# Altium schematic sheet alim_portes_logic.SchDoc
size A4; SheetNumber: 2; SheetTotal: 6
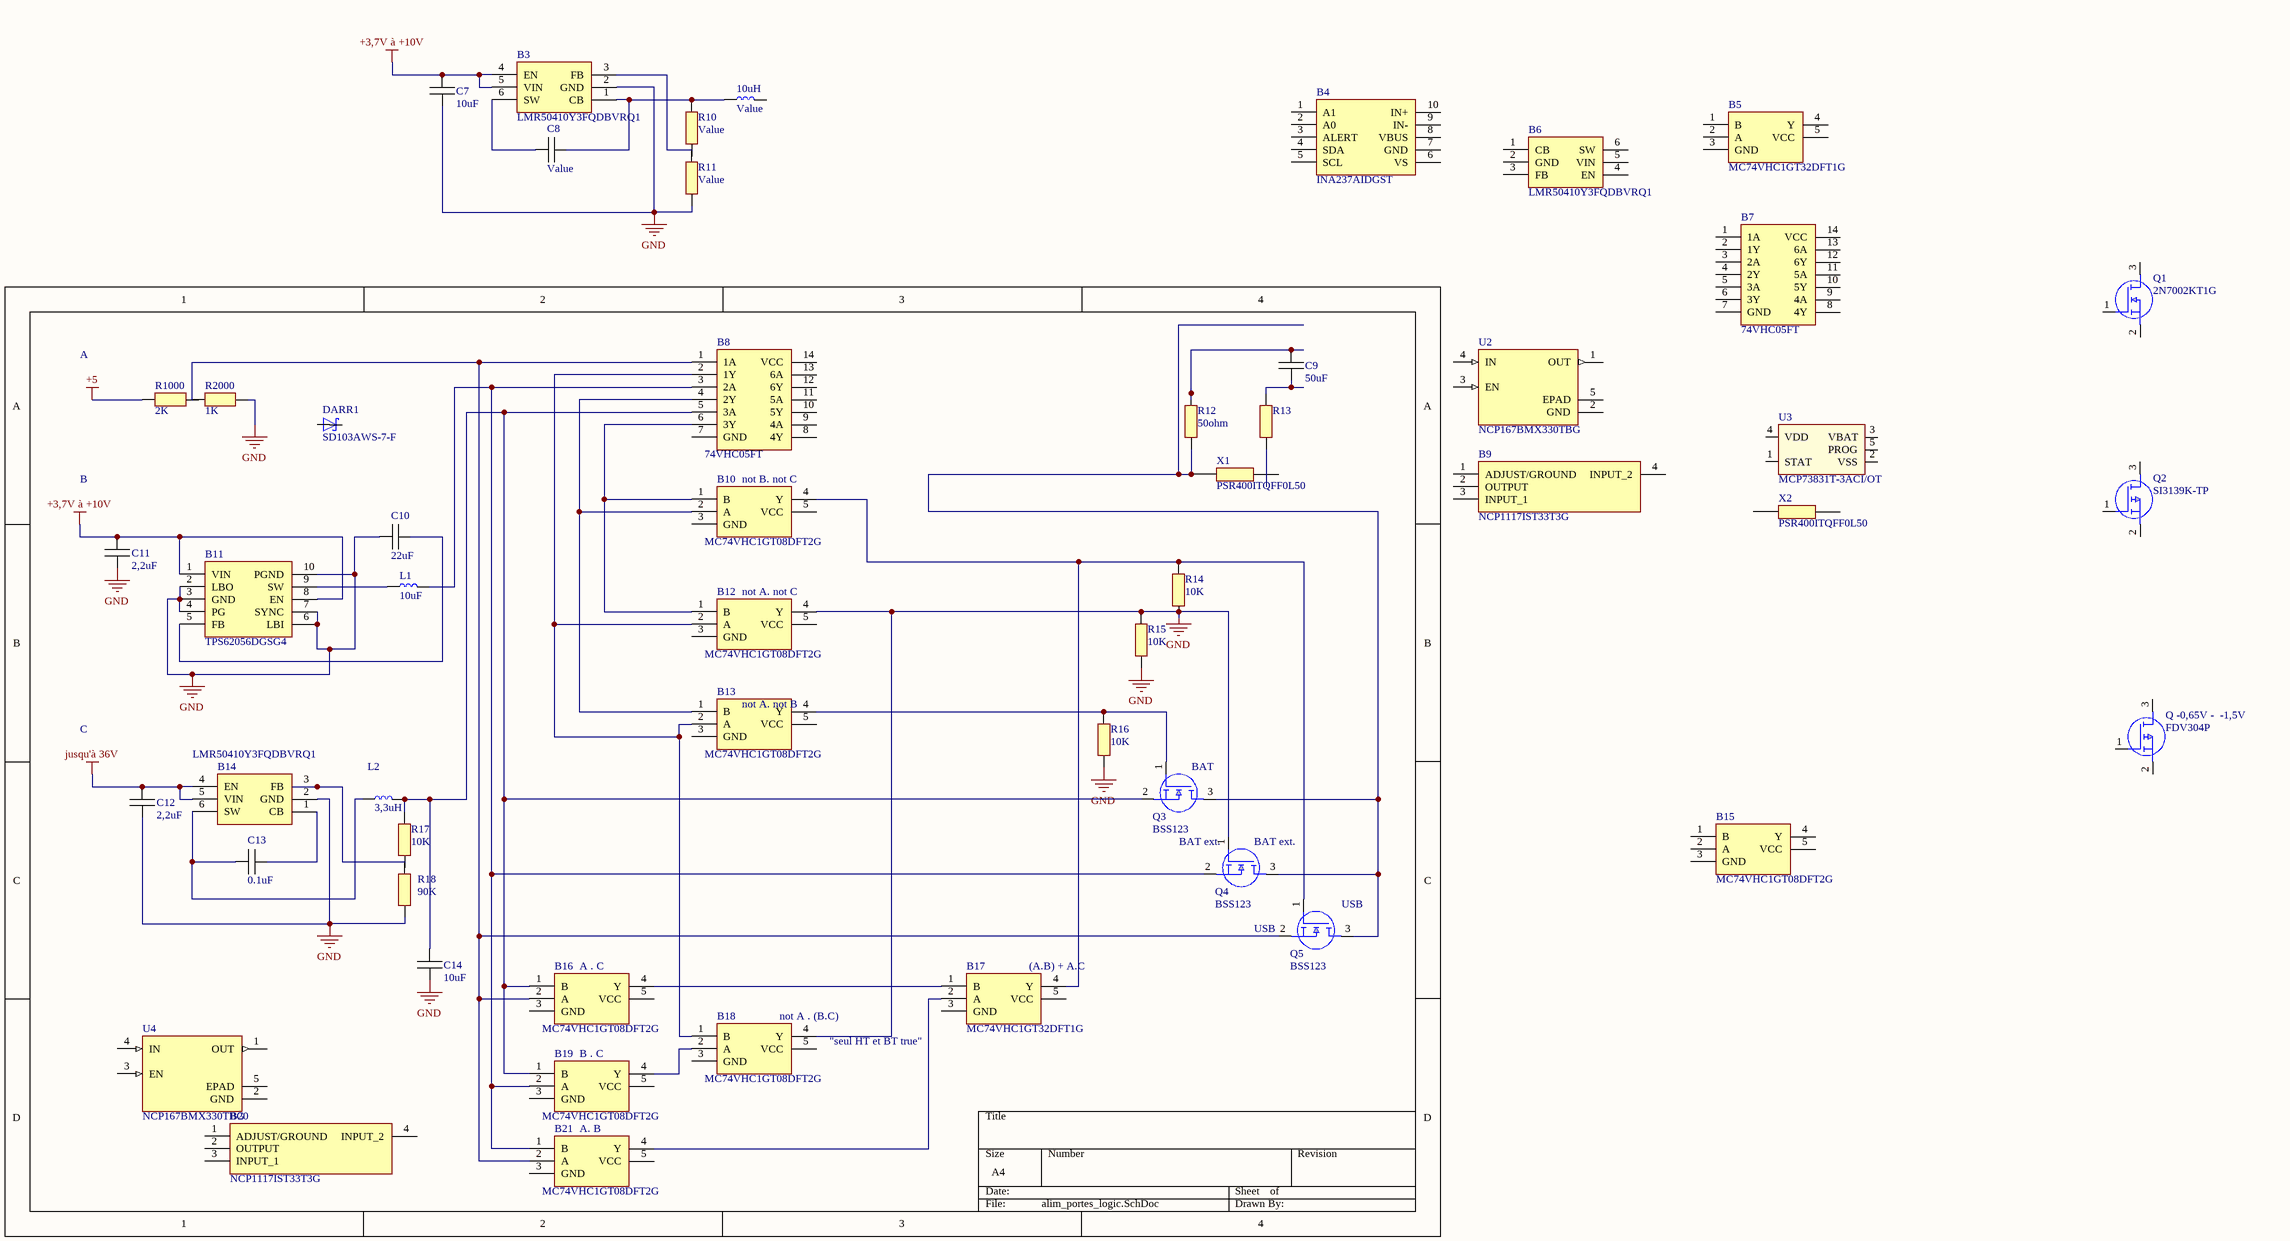
[diagram p0: alim_portes_logic.SchDoc]

## Parts
10uH  Value  [LQPC1005X06N]
B3  LMR50410Y3FQDBVRQ1  [SOT95P280X145-6N]
B4  INA237AIDGST  [SOP50P490X110-10N]
B5  MC74VHC1GT32DFT1G  [SOT65P210X110-5N]
B6  LMR50410Y3FQDBVRQ1  [SOT95P280X145-6N]
B7  74VHC05FT  [SOP65P640X120-14N]
B8  74VHC05FT  [SOP65P640X120-14N]
B9  NCP1117IST33T3G  [SOT230P700X180-4N]
B10  MC74VHC1GT08DFT2G  [SOT65P210X110-5N]
B11  TPS62056DGSG4  [SOP50P490X110-10N]
B12  MC74VHC1GT08DFT2G  [SOT65P210X110-5N]
B13  MC74VHC1GT08DFT2G  [SOT65P210X110-5N]
B14  LMR50410Y3FQDBVRQ1  [SOT95P280X145-6N]
B15  MC74VHC1GT08DFT2G  [SOT65P210X110-5N]
B16  MC74VHC1GT08DFT2G  [SOT65P210X110-5N]
B17  MC74VHC1GT32DFT1G  [SOT65P210X110-5N]
B18  MC74VHC1GT08DFT2G  [SOT65P210X110-5N]
B19  MC74VHC1GT08DFT2G  [SOT65P210X110-5N]
B20  NCP1117IST33T3G  [SOT230P700X180-4N]
B21  MC74VHC1GT08DFT2G  [SOT65P210X110-5N]
C7  10uF  [CAPC1005X06N]
C8  Value  [CAPC1005X06N]
C9  50uF  [CAPC1005X06N]
C10  22uF  [CAPC1005X06N]
C11  2,2uF  [CAPC1005X06N]
C12  2,2uF  [CAPC1005X06N]
C13  0.1uF  [CAPC1005X06N]
C14  10uF  [CAPC1005X06N]
DARR1  SD103AWS-7-F  [SD103AWS-7-F]
L1  10uF  [LQPC1005X06N]
L2  3,3uH  [LQPC1005X06N]
Q1  2N7002KT1G  [SOT96P237X111-3N]
Q2  SI3139K-TP  [SI3139K-TP]
Q3  BSS123  [BSS123]
Q4  BSS123  [BSS123]
Q5  BSS123  [BSS123]
Q_-0,65V_-_-1,5V  FDV304P  [SOT95P251X112-3N]
R10  Value  [RESC1005X06N]
R11  Value  [RESC1005X06N]
R12  50ohm  [RESC1005X06N]
R13  (no value)  [RESC1005X06N]
R14  10K  [RESC1005X06N]
R15  10K  [RESC1005X06N]
R16  10K  [RESC1005X06N]
R17  10K  [RESC1005X06N]
R18  90K  [RESC1005X06N]
R1000  2K  [RESC1005X06N]
R2000  1K  [RESC1005X06N]
U2  NCP167BMX330TBG  [NCP167BMX330TBG]
U3  MCP73831T-3ACI/OT  [SOT95P280X145-5N]
U4  NCP167BMX330TBG  [NCP167BMX330TBG]
X1  PSR400ITQFF0L50  [RESC10052X200N]
X2  PSR400ITQFF0L50  [RESC10052X200N]

## Nets
+3,7V à +10V: B3.4(EN) B3.5(VIN) B11.1(VIN) B11.8(EN) C7.1 C11.1
+5: R1000.1
GND: B3.2(GND) B11.2(LBO) B11.3(GND) B11.4(PG) B11.6(LBI) B11.7(SYNC) B11.10(PGND) B12.4(Y) B14.2(GND) B18.4(Y) C7.2 C10.2 C11.2 C12.2 C14.2 Q4.1(G) R11.2 R14.2 R15.1 R15.2 R16.2 R18.2 R2000.2
jusqu'à 36V: B14.4(EN) B14.5(VIN) C12.1
Net10uH_1: 10uH.1 B3.1(CB) C8.1 R10.1
NetB3_3: B3.3(FB) R11.1
NetB3_6: B3.6(SW) C8.2
NetB8_1: B8.1(1A) B16.2(A) B21.2(A) Q5.2(S) R2000.1
NetB8_2: B8.2(1Y) B12.2(A) B13.2(A) B18.1(B)
NetB8_3: B8.3(2A) B19.2(A) B21.1(B) L1.2 Q4.2(S)
NetB8_4: B8.4(2Y) B10.2(A) B13.1(B)
NetB8_5: B8.5(3A) B16.1(B) B19.1(B) C14.1 L2.2 Q3.2(S) R17.1
NetB8_6: B8.6(3Y) B10.1(B) B12.1(B)
NetB10_4: B10.4(Y) B17.4(Y) Q5.1(G) R14.1
NetB11_5: B11.5(FB) C10.1
NetB11_9: B11.9(SW) L1.1
NetB13_4: B13.4(Y) Q3.1(G) R16.1
NetB14_1: B14.1(CB) C13.1
NetB14_3: B14.3(FB) R18.1
NetB14_6: B14.6(SW) C13.2 L2.1
NetB16_4: B16.4(Y) B17.1(B)
NetB17_2: B17.2(A) B21.4(Y)
NetB18_2: B18.2(A) B19.4(Y)
NetC9_1: C9.1 R12.2
NetC9_2: C9.2 R13.2
NetQ3_3: Q3.3(D) Q4.3(D) Q5.3(D) R12.1 X1.1

Not connected (* = marked no-connect by the designer): 10uH 2; B4 1(A1) 2(A0) 3(ALERT) 4(SDA) 5(SCL) 6(VS) 7(GND) 8(VBUS) 9(IN-) 10(IN+); B5 1(B) 2(A) 3(GND) 4(Y) 5(VCC); B6 1(CB) 2(GND) 3(FB) 4(EN) 5(VIN) 6(SW); B7 1(1A) 2(1Y) 3(2A) 4(2Y) 5(3A) 6(3Y) 7(GND) 8(4Y) 9(4A) 10(5Y) 11(5A) 12(6Y) 13(6A) 14(VCC); B8 7(GND) 8(4Y) 9(4A) 10(5Y) 11(5A) 12(6Y) 13(6A) 14(VCC); B9 1(ADJUST/GROUND) 2(OUTPUT) 3(INPUT_1) 4(INPUT_2); B10 3(GND) 5(VCC); B12 3(GND) 5(VCC); B13 3(GND) 5(VCC); B15 1(B) 2(A) 3(GND) 4(Y) 5(VCC); B16 3(GND) 5(VCC); B17 3(GND) 5(VCC); B18 3(GND) 5(VCC); B19 3(GND) 5(VCC); B20 1(ADJUST/GROUND) 2(OUTPUT) 3(INPUT_1) 4(INPUT_2); B21 3(GND) 5(VCC); DARR1 1(C) 2(A); Q1 1(G) 2(S) 3(D); Q2 1(G) 2(S) 3(D); Q_-0,65V_-_-1,5V 1(G) 2(S) 3(D); R10 2; R13 1; R17 2; R1000 2; U2 1(OUT) 2(GND) 3(EN) 4(IN) 5(EPAD); U3 1(STAT) 2(VSS) 3(VBAT) 4(VDD) 5(PROG); U4 1(OUT) 2(GND) 3(EN) 4(IN) 5(EPAD); X1 2; X2 1 2

## Notes on the sheet
- A
- B
- (near B10) not B. not C
- (near B12) not A. not C
- C
- (near B13) not A. not B
- (near Q3) BAT
- (near Q4) BAT ext.
- (near Q5) USB
- (near B16) A . C
- (near B17) (A.B) + A.C
- (near B19) B . C
- (near B18) not A . (B.C)
- "seul HT et BT true"
- (near B21) A. B

## Library data of the parts
10uH L1 L2 = Bobine
B3 B6 B14 = LMR50410Y3FQDBVRQ1: Régulateurs de tension de commutation Automotive qualified SIMPLE SWITCHER 4-V to 36-V, 1-A synchronous step-down converter 6-SOT-23 -40 to 150; Manufacturer_Name: Texas Instruments; Manufacturer_Part_Number: LMR50410Y3FQDBVRQ1; Mouser Part Number: 595-R50410Y3FQDBVRQ1
B4 = INA237AIDGST: Current Sense Amplifiers 85-V, 16-bit, I2C output current/voltage/power monitor with alert 10-VSSOP -40 to 125; Manufacturer_Name: Texas Instruments; Manufacturer_Part_Number: INA237AIDGST; Mouser Part Number: 595-INA237AIDGST
B5 B17 = MC74VHC1GT32DFT1G: Single 2-Input OR Gate, TTL Level; Manufacturer_Name: onsemi; Manufacturer_Part_Number: MC74VHC1GT32DFT1G; Mouser Part Number: 863-C74VHC1GT32DFT1G
B7 B8 = 74VHC05FT: Logic Gates CMOS LOGIC IC INVERTER; Manufacturer_Name: Toshiba; Manufacturer_Part_Number: 74VHC05FT; Mouser Part Number: 757-74VHC05FT
B9 B20 = NCP1117IST33T3G: Linear Voltage Regulator IC Positive Fixed 1 Output 1A SOT-223; Parameter 1: onsemi; Parameter 3: 863-NCP1117IST33T3G; Parameter 2: NCP1117IST33T3G
B10 B12 B13 B15 B16 B18 B19 B21 = MC74VHC1GT08DFT2G: Single 2-Input AND Gate, TTL Level; Manufacturer_Name: onsemi; Manufacturer_Part_Number: MC74VHC1GT08DFT2G; Parameter 3: *
B11 = TPS62056DGSG4: TEXAS INSTRUMENTS - TPS62056DGSG4 - Synchronous Buck (Step Down) Switching Regulator, Fixed, 2.7V-10Vin, 3.3V/0.8A out, 850kHz, VSSOP-10; Manufacturer_Name: Texas Instruments; Manufacturer_Part_Number: TPS62056DGSG4; Mouser Part Number: 595-TPS62056DGSG4
C7-C14 = Capacitor
DARR1 = SD103AWS-7-F: Diode Array 3 Independent Schottky 40V 175mA Surface Mount 6-TSSOP, SC-88, SOT-363
Q1 = 2N7002KT1G: MOSFET N-Ch 60V 380mA Small Signal SOT23 ON Semiconductor 2N7002KT1G N-channel MOSFET Transistor, 380 mA, 60 V, 3-Pin SOT-23; Manufacturer_Name: onsemi; Geometry.Height: 1.11mm; Manufacturer_Part_Number: 2N7002KT1G; Mouser Part Number: 863-2N7002KT1G; Mouser Price/Stock: https://www.mouser.co.uk/ProductDetail/onsemi/2N7002KT1G?qs=Jh7l0IbPjifUiTytu%252BGGDQ%3D%3D; Arrow Part Number: 2N7002KT1G; Arrow Price/Stock: https://www.arrow.com/en/products/2n7002kt1g/on-semiconductor?utm_currency=USD&region=nac; Datasheet Link: http://www.onsemi.com/pub/Collateral/2N7002K-D.PDF
Q2 = SI3139K-TP: MOSFET P-Channel MOSFET
Q3-Q5 = BSS123: BSS123 N-Channel MOSFET, 170 mA, 100 V PowerTrench, 3-Pin SOT-23 ON Semiconductor
Q_-0,65V_-_-1,5V = FDV304P: ON SEMICONDUCTOR - FDV304P - Power MOSFET, P Channel, 25 V, 460 mA, 1.22 ohm, SOT-23, Surface Mount; Manufacturer_Name: onsemi; Geometry.Height: 1.12mm; Manufacturer_Part_Number: FDV304P; Mouser Part Number: 512-FDV304P; Mouser Price/Stock: https://www.mouser.co.uk/ProductDetail/onsemi-Fairchild/FDV304P?qs=FOlmdCx%252BAA1BAlCQZu888w%3D%3D; Arrow Part Number: FDV304P; Arrow Price/Stock: https://www.arrow.com/en/products/fdv304p/on-semiconductor?utm_currency=USD&region=europe; Datasheet Link: https://componentsearchengine.com/Datasheets/2/FDV304P.pdf
R10-R18 R1000 R2000 = Resistor
U2 U4 = NCP167BMX330TBG: Régulateurs de tension LDO LDO 700 MA ULTRA-LOW NOISE 3.3V
U3 = BatteryManager: Gestion de batterie/pile Charge mgnt contr; Manufacturer 1: Microchip Technology; Supplier 1: Arrow Electronics; Supplier Part Number 1: MCP73831T-3ACI/OT; Manufacturer Part Number 1: MCP73831T-3ACI/OT
X1 X2 = PSR400ITQFF0L50: ROHM - PSR400ITQFF0L50 - SMD Current Sense Resistor, 500 ohm, PSR Series, 3921 [1052 Metric], 4 W, +/- 1%, Metal Strip; Manufacturer_Name: ROHM Semiconductor; Geometry.Height: 2mm; Manufacturer_Part_Number: PSR400ITQFF0L50; Mouser Part Number: 755-PSR400ITQFF0L50; Mouser Price/Stock: https://www.mouser.co.uk/ProductDetail/ROHM-Semiconductor/PSR400ITQFF0L50?qs=493kPxzlxfLaT1w5Mo%252BtHg%3D%3D; Arrow Part Number: *; Arrow Price/Stock: *; Datasheet Link: https://componentsearchengine.com/Datasheets/2/PSR400ITQFF0L50.pdf